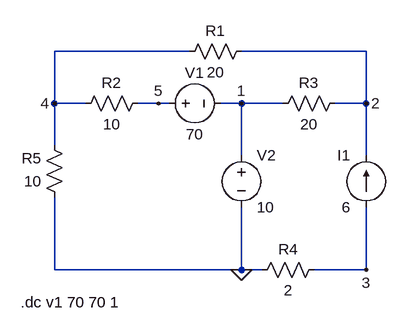
[diagram p0: schematic Draft5.asc]
Draft5.asc, the LTspice schematic file:
Version 4
SHEET 1 880 680
WIRE 208 32 0 32
WIRE 480 32 288 32
WIRE 0 112 0 32
WIRE 48 112 0 112
WIRE 160 112 128 112
WIRE 176 112 160 112
WIRE 288 112 256 112
WIRE 352 112 288 112
WIRE 480 112 480 32
WIRE 480 112 432 112
WIRE 0 176 0 112
WIRE 288 192 288 112
WIRE 480 192 480 112
WIRE 0 368 0 256
WIRE 288 368 288 272
WIRE 288 368 0 368
WIRE 320 368 288 368
WIRE 480 368 480 272
WIRE 480 368 400 368
FLAG 288 368 0
FLAG 288 112 1
FLAG 480 112 2
FLAG 480 368 3
FLAG 0 112 4
FLAG 160 112 5
SYMBOL res 304 16 R90
WINDOW 0 0 56 VBottom 2
WINDOW 3 32 56 VTop 2
SYMATTR InstName R1
SYMATTR Value 20
SYMBOL res 144 96 R90
WINDOW 0 0 56 VBottom 2
WINDOW 3 32 56 VTop 2
SYMATTR InstName R2
SYMATTR Value 10
SYMBOL res 448 96 R90
WINDOW 0 0 56 VBottom 2
WINDOW 3 32 56 VTop 2
SYMATTR InstName R3
SYMATTR Value 20
SYMBOL res 16 272 R180
WINDOW 0 36 76 Left 2
WINDOW 3 36 40 Left 2
SYMATTR InstName R5
SYMATTR Value 10
SYMBOL current 480 272 R180
WINDOW 0 24 80 Left 2
WINDOW 3 24 0 Left 2
WINDOW 123 0 0 Left 0
WINDOW 39 0 0 Left 0
SYMATTR InstName I1
SYMATTR Value 6
SYMBOL voltage 160 112 R270
WINDOW 0 32 56 VTop 2
WINDOW 3 -32 56 VBottom 2
WINDOW 123 0 0 Left 0
WINDOW 39 0 0 Left 0
SYMATTR InstName V1
SYMATTR Value 70
SYMBOL voltage 288 176 R0
WINDOW 123 0 0 Left 0
WINDOW 39 0 0 Left 0
SYMATTR InstName V2
SYMATTR Value 10
SYMBOL res 416 352 R90
WINDOW 0 0 56 VBottom 2
WINDOW 3 32 56 VTop 2
SYMATTR InstName R4
SYMATTR Value 2
TEXT -52 418 Left 2 !.dc v1 70 70 1

The netlist it stands for:
* Draft5.asc
R1 2 4 20
R2 5 4 10
R3 2 1 20
R5 0 4 10
I1 3 2 6
V1 5 1 70
V2 1 0 10
R4 3 0 2
.dc v1 70 70 1
.backanno
.end

* Results of the author's LTspice run, read from the files saved beside the schematic
* DC transfer characteristic:
*   v1 = 70 
*   V(2) = 90 V
*   V(4) = 50 V
*   V(5) = 80 V
*   V(1) = 10 V
*   V(3) = -12 V
*   I(I1) = 6 A
*   I(R4) = -6 A
*   I(R5) = -5 A
*   I(R3) = 4 A
*   I(R2) = 3 A
*   I(R1) = 2 A
*   I(V2) = 1 A
*   I(V1) = -3 A